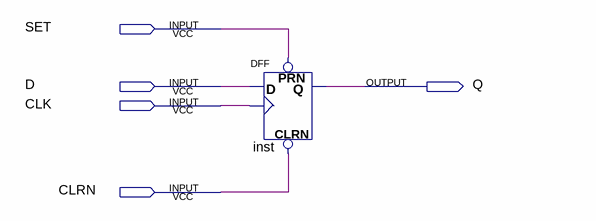
[diagram p0: schematic sheet]
// Quartus schematic Question4.bdf as structural Verilog: 1 symbols, 5 pins
module Question4 (
  input  SET,
  input  D,
  input  CLK,
  input  CLRN,
  output Q
);

  DFF inst (.CLRN(CLRN), .CLK(CLK), .D(D), .PRN(SET), .Q(Q));
endmodule
